# Altium schematic sheet 01 - Main.SchDoc: NRF Sensor
size A4; DocumentNumber: 1; Revision: 1.0.0; SheetNumber: 1; SheetTotal: 1
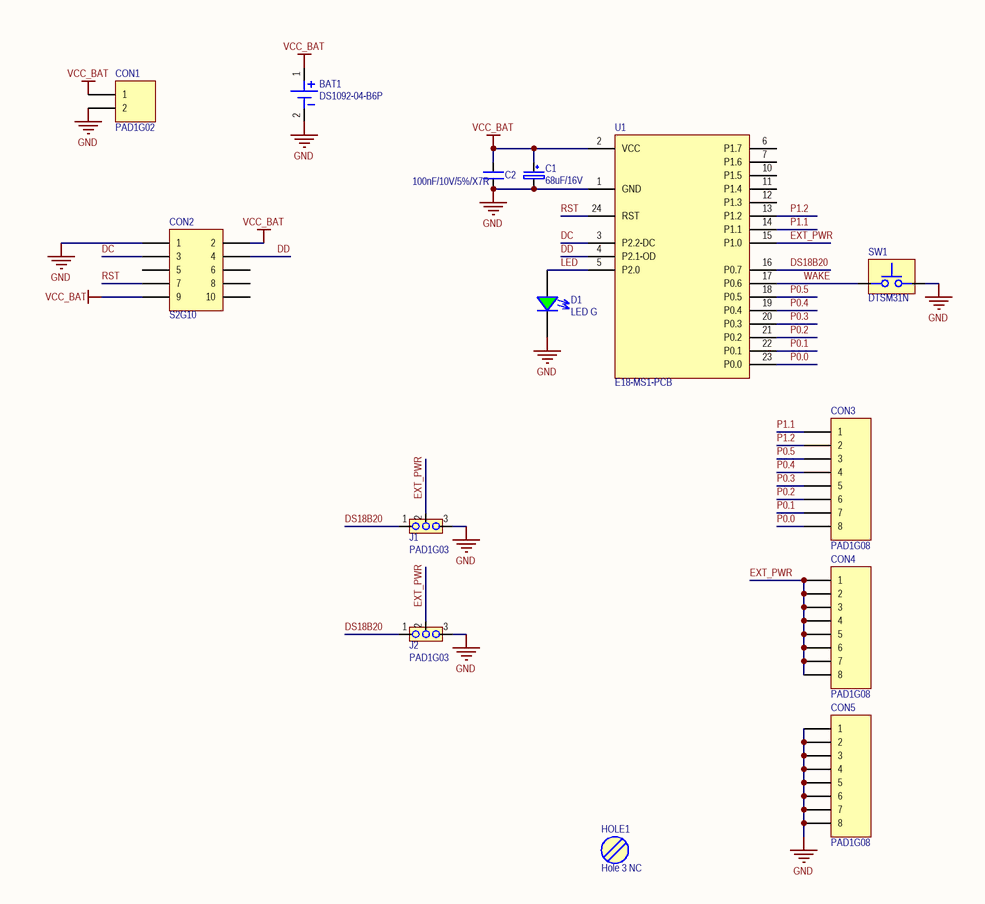
[diagram p0: 01 - Main.SchDoc]

## Parts
BAT1  DS1092-04-B6P  [DS1092-04-B6P]
C1  68uF/16V  [C-SMDD]
C2  100nF/10V/5%/X7R  [C-0603]
CON1  PAD1G02  [HDR1X02S]
CON2  S2G10  [HDR2X10]
CON3  PAD1G08  [HDR1X08S]
CON4  PAD1G08  [HDR1X08S]
CON5  PAD1G08  [HDR1X08S]
D1  LED G  [LED-0603 GREEN]
HOLE1  Hole 3 NC  [Hole 3 NC]  (no BOM)
J1  PAD1G03  [HDR1X03S]
J2  PAD1G03  [HDR1X03S]
SW1  DTSM31N  [DTSM31N]
U1  E18-MS1-PCB  [MS1-E18-PCB]

## Nets
GND: BAT1.2(-) C1.2 C2.1 CON1.2 CON2.1 CON5.1 CON5.2 CON5.3 CON5.4 CON5.5 CON5.6 CON5.7 CON5.8 D1.1(K) J1.3 J2.3 SW1.2 U1.1(GND)
VCC_BAT: BAT1.1(+) C1.1 C2.2 CON1.1 CON2.2 CON2.9 U1.2(VCC)
DC: CON2.3 U1.3(P2.2-DC)
DD: CON2.4 U1.4(P2.1-OD)
DS18B20: J1.1 J2.1 U1.16(P0.7)
EXT_PWR: CON4.1 CON4.2 CON4.3 CON4.4 CON4.5 CON4.6 CON4.7 CON4.8 J1.2 J2.2 U1.15(P1.0)
LED: D1.2(A) U1.5(P2.0)
P0.0: CON3.8 U1.23(P0.0)
P0.1: CON3.7 U1.22(P0.1)
P0.2: CON3.6 U1.21(P0.2)
P0.3: CON3.5 U1.20(P0.3)
P0.4: CON3.4 U1.19(P0.4)
P0.5: CON3.3 U1.18(P0.5)
P1.1: CON3.1 U1.14(P1.1)
P1.2: CON3.2 U1.13(P1.2)
RST: CON2.7 U1.24(RST)
WAKE: SW1.1 U1.17(P0.6)

Not connected (* = marked no-connect by the designer): CON2 5 6 8 10; U1 6(P1.7) 7(P1.6) 10(P1.5) 11(P1.4) 12(P1.3)

## Notes on the sheet
- Title
- Size:
- Sheet
- A4
- Number:
- Revision:
- Date:
- Time:
- of

## Library data of the parts
C1 = CMP-034-0078-5: SMD Tantalum Capacitor SMDD 68uF/16V; Voltage: 16V; IFS Description prefix: CAP-SMDD 68uF/16V; IFS PN: 100108; Capacitance: 68uF; Case/Package: SMDD
C2 = CMP-001-00101-1: SMD Ceramic Capacitor 0603 100nF/10V/5%/X7R; Dielectric: X7R; IFS PN: 102686; Voltage: 10V; Capacitance: 100nF; IFS Description prefix: CAP-0603 4.7uF/10V/10%/X5R; Tolerance: 5%; Case/Package: 0603
CON1 = CMP-051-0005-3: 1x2pin single row pads, 2.54mm; IFS Description prefix: CON-PAD1G02
CON2 = CMP-002-00023-1: 2x5pin dual row header, 2.54mm; IFS Description prefix: CON-S2G10
CON3-CON5 = CMP-051-0045-3: 1x8pin single row pads, 2.54mm; IFS Description prefix: CON-PAD1G08
D1 = CMP-056-0009-6: LED; SMD; 0603; zelená; 4-15mcd; 1,6x0,8x1,1mm; 120°; 2,2÷2,5V; 20mA; IFS PN: 114766; IFS Description prefix: DIO-KP-1608SGC; Case/Package: LED-0603
HOLE1 = CMP-065-0000-4: Hole 3mm Unconnected
J1 J2 = CMP-051-0077-3: 3 pin jumper; IFS Description prefix: CON-PAD1G03
SW1 = CMP-067-0003-3: SMT tactile switch, 2 pin; IFS Description prefix: SWI-DTSM31N; IFS PN: 100177; HelpURL: http://www.tme.eu/cz/Document/d1cb889bed37184cf06c8c8c7295a613/DTS-3,%20DTSML_L_-3-V.pdf